# EAGLE design tek611 (EAGLE 6.6.0)
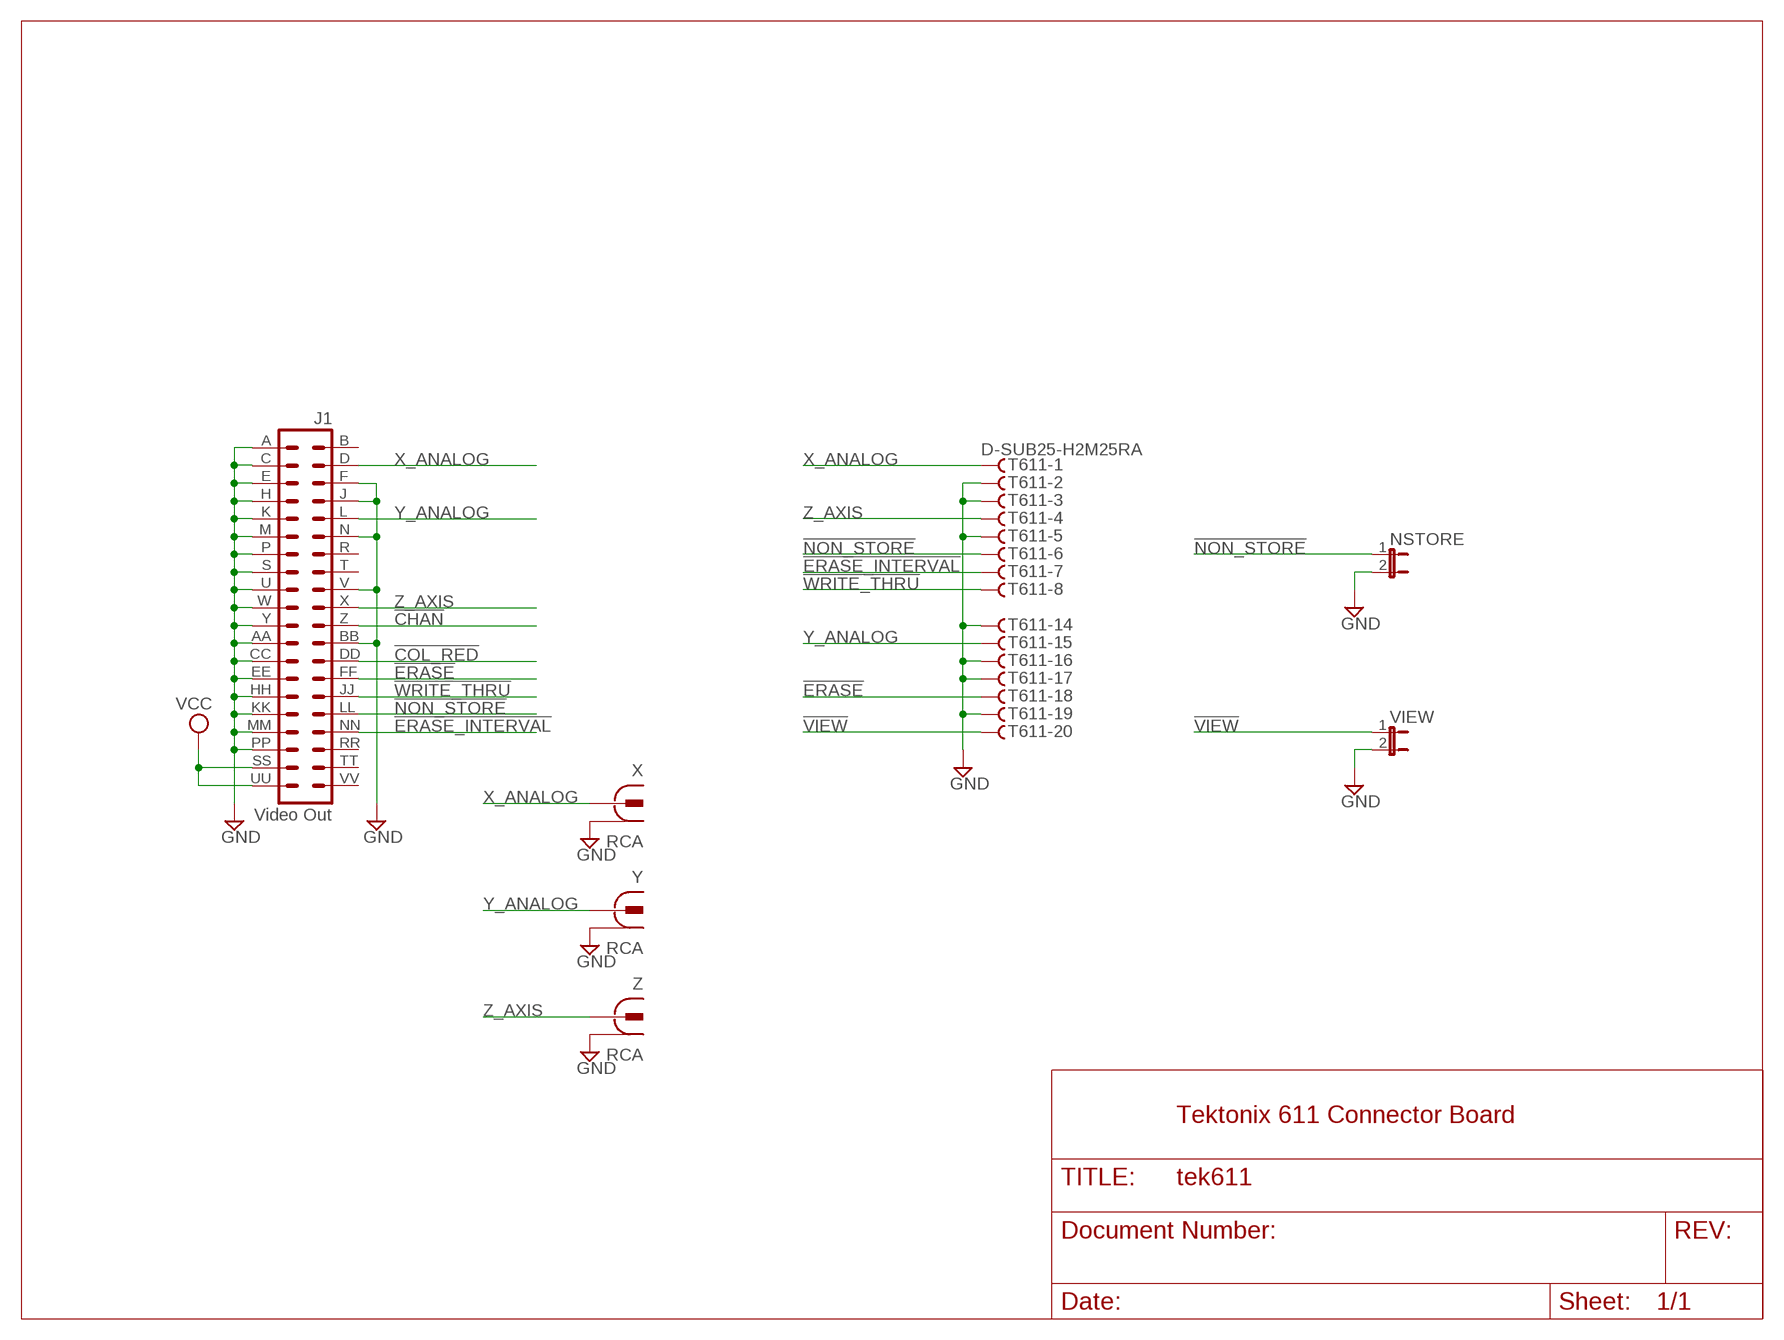
[diagram p0: schematic, sheet 1]

## Parts
J1  Video Out  DEC40PINH  [DEC40PINH]
NSTORE  JP1E  [JP1]
T611  D-SUB25-H2M25RA  [H2M25RA]
VIEW  JP1E  [JP1]
X  RCA  [RCA]
Y  RCA  [RCA]
Z  RCA  [RCA]

## Nets
!CHAN: J1.Z
!COL_RED: J1.DD
!ERASE: J1.FF T611.18
!ERASE_INTERVAL: J1.NN T611.7
!NON_STORE: J1.LL NSTORE.1 T611.6
!VIEW: T611.20 VIEW.1
!WRITE_THRU: J1.JJ T611.8
GND: J1.A J1.AA J1.BB J1.C J1.CC J1.E J1.EE J1.F J1.H J1.HH J1.J J1.K J1.KK J1.M J1.MM J1.N J1.P J1.PP J1.S J1.U J1.V J1.W J1.Y NSTORE.2 T611.2 T611.3 T611.5 T611.14 T611.16 T611.17 T611.19 VIEW.2 X.1 X.1@1 X.1@2 Y.1 Y.1@1 Y.1@2 Z.1 Z.1@1 Z.1@2
VCC [supply]: J1.SS J1.UU
X_ANALOG: J1.D T611.1 X.2
Y_ANALOG: J1.L T611.15 Y.2
Z_AXIS: J1.X T611.4 Z.2
Unconnected: J1.B J1.R J1.RR J1.T J1.TT J1.VV T611.9 T611.10 T611.11 T611.12 T611.13 T611.21 T611.22 T611.23 T611.24 T611.25

## Notes on the sheet
- Tektonix 611 Connector Board

## Library data of the parts
J1 = dec-con:DEC40PIN: PIN HEADER
NSTORE VIEW = jumper:JP1E: JUMPER
T611 = con-thomas-betts:D-SUB25-: D-Subminiatur Connector Source: Electronioc Interconnects European Edition 1998; OC_FARNELL: unknown; OC_NEWARK: unknown
X Y Z = dec-con:RCA: RCA Jack

## Net classes
0 default: width 0.61 mm
1 supply: width 0.61 mm

## Board
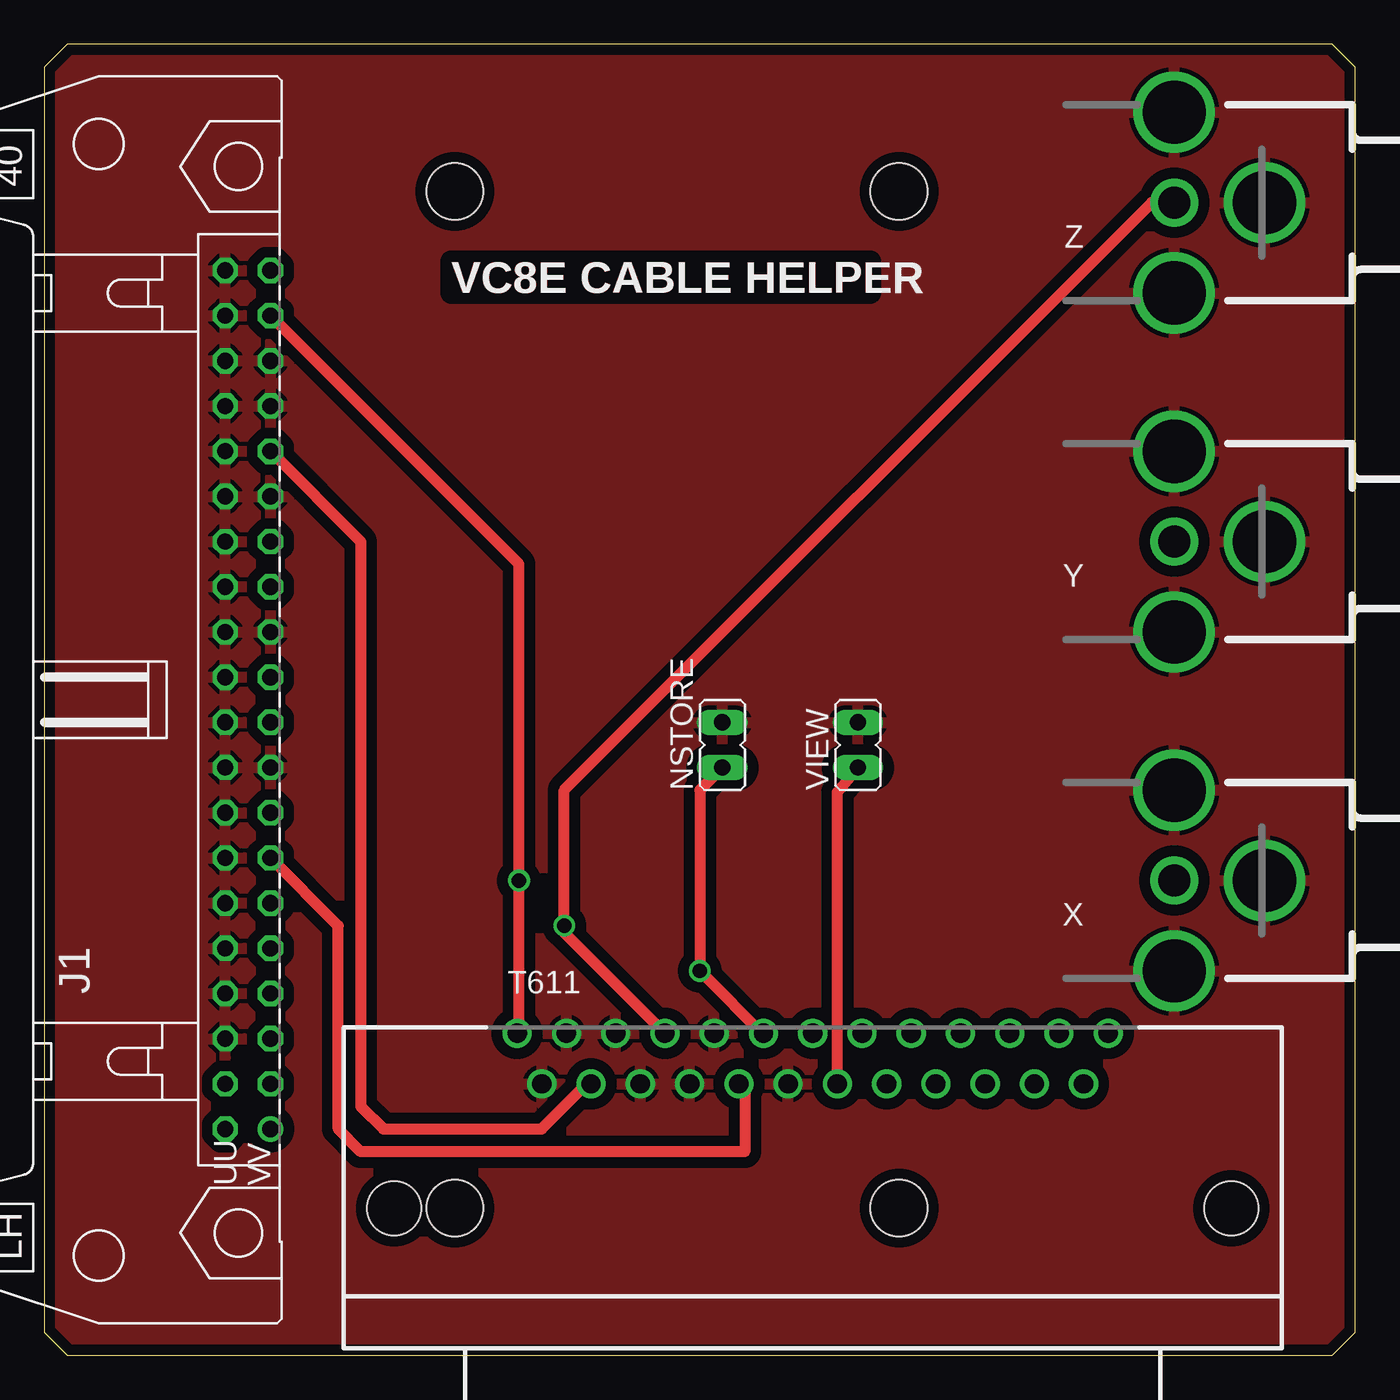
[diagram p1: board, top side]
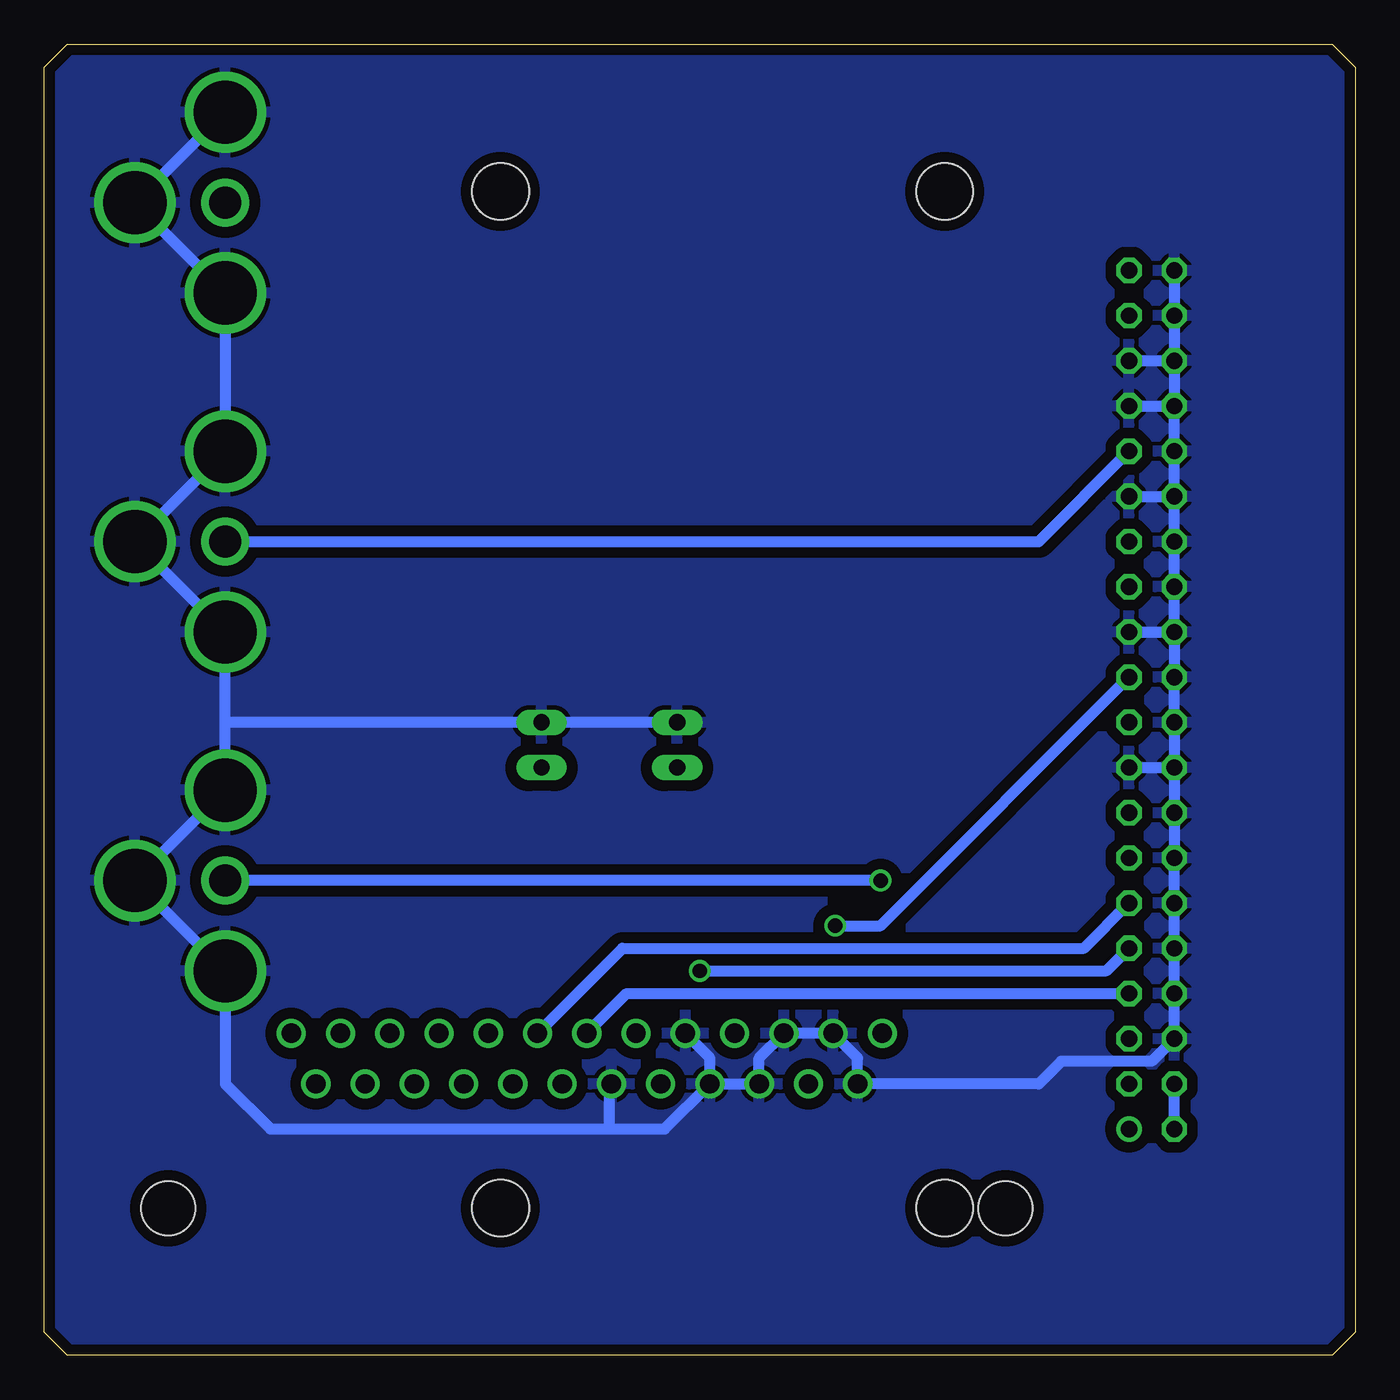
[diagram p2: board, bottom side, seen from below]

Size 73.66 x 73.66 mm. Coordinates in mm from the lower left corner, seen from the top.
Outline: 1.27,0 72.39,0 73.66,1.27 73.66,72.39 72.39,73.66 1.27,73.66 0,72.39 0,1.27 1.27,0
Copper layers (1+16): Top 0.035mm / dielectric 1.5mm / Bottom 0.035mm
Design rules "16mils": minimum track width 16mil, minimum drill 32mil, track to track 15mil, track to pad 10mil, pad to pad 10mil, via to via 10mil, smd to smd 10mil, copper to edge 13mil, drill to drill 10mil, minimum pad ring 10mil, minimum via ring 8mil, stop-mask expansion 0mil, vias tented up to drill 0mil, thermal gap 10mil
Holes 3.2 mm at 23.06,65.41 23.06,8.26 48.03,8.26 48.03,65.41

### Footprints (pad centres in the part's own frame; a part is rotated, then mirrored left to right if it is on the bottom)
DEC40PINH = drill 0.914 octagon: A 24.13,1.27; AA -3.81,1.27; B 24.13,-1.27; BB -3.81,-1.27; C 21.59,1.27; CC -6.35,1.27; D 21.59,-1.27; DD -6.35,-1.27; E 19.05,1.27; EE -8.89,1.27; F 19.05,-1.27; FF -8.89,-1.27; H 16.51,1.27; HH -11.43,1.27; J 16.51,-1.27; JJ -11.43,-1.27; K 13.97,1.27; KK -13.97,1.27; L 13.97,-1.27; LL -13.97,-1.27; M 11.43,1.27; MM -16.51,1.27; N 11.43,-1.27; NN -16.51,-1.27; P 8.89,1.27; PP -19.05,1.27; R 8.89,-1.27; RR -19.05,-1.27; S 6.35,1.27; SS -21.59,1.27; T 6.35,-1.27; TT -21.59,-1.27; U 3.81,1.27; UU -24.13,1.27; V 3.81,-1.27; W 1.27,1.27; X 1.27,-1.27; Y -1.27,1.27; Z -1.27,-1.27 | drill 0.914: VV -24.13,-1.27
JP1 = drill 0.914 long: 1 0,-1.27; 2 0,1.27
H2M25RA = drill 1.092: 1 -16.612,7.925; 2 -13.843,7.925; 3 -11.074,7.925; 4 -8.306,7.925; 5 -5.537,7.925; 6 -2.769,7.925; 7 0,7.925; 8 2.769,7.925; 9 5.537,7.925; 10 8.306,7.925; 11 11.074,7.925; 12 13.843,7.925; 13 16.612,7.925; 14 -15.227,5.08; 15 -12.459,5.08; 16 -9.69,5.08; 17 -6.921,5.08; 18 -4.153,5.08; 19 -1.384,5.08; 20 1.384,5.08; 21 4.153,5.08; 22 6.921,5.08; 23 9.69,5.08; 24 12.459,5.08; 25 15.227,5.08 | hole 3.048: -23.52,-1.905; 23.52,-1.905
RCA = drill 3.556: 1 -5.08,0; 1@1 0,-5.08; 1@2 0,5.08 | drill 1.8: 2 0,0

### Placement (x,y rotation side)
J1  11.43,36.83 90 top
NSTORE  38.1,34.29 0 top
T611  43.18,10.16 0 top
VIEW  45.72,34.29 0 top
X  63.5,26.67 180 top
Y  63.5,45.72 180 top
Z  63.5,64.77 180 top

### Tracks (layer width: path | path; a pad name or v marks a point on that pad's centre or on a via)
!ERASE
  Top 0.61: J1.FF 16.51,24.13 16.51,12.7 17.78,11.43 39.37,11.43 39.37,15.24 T611.18
!ERASE_INTERVAL
  Bottom 0.61: J1.NN 40.95,20.32 T611.7
!NON_STORE  (via drill 0.81)
  Top 0.61: T611.6 40.64,17.78 v36.83,21.59 36.83,31.75 NSTORE.1
  Bottom 0.61: J1.LL 13.97,21.59 v36.83,21.59
!VIEW
  Top 0.61: T611.20 44.56,31.64 VIEW.1
!WRITE_THRU
  Bottom 0.61: J1.JJ 15.24,22.86 41.17,22.86 T611.8
GND
  Bottom 0.61: J1.A J1.C J1.E | J1.F J1.E | J1.J J1.H | J1.E J1.H | J1.N J1.M | J1.M J1.K J1.H | J1.BB J1.AA | J1.AA J1.CC J1.EE J1.HH J1.KK J1.MM J1.PP 11.43,16.51 16.51,16.51 17.78,15.24 T611.14 27.95,16.7 T611.2 T611.3 33.49,16.7 T611.16 T611.17 | J1.AA J1.Y J1.W J1.U | J1.V J1.U | J1.U J1.S J1.P J1.M | 63.5,35.56 X.1@1 X.1 X.1@2 63.5,15.24 60.96,12.7 41.91,12.7 | 63.5,35.56 Y.1@2 Y.1 Y.1@1 Z.1@2 Z.1 Z.1@1 | T611.17 36.26,16.7 T611.5 | T611.17 38.8,12.7 41.91,12.7 | 41.91,12.7 41.91,15.13 T611.19 | 63.5,35.56 VIEW.2 NSTORE.2
  pour Top (isolate 0.61): 0,0 73.66,0 73.66,73.66 0,73.66
  pour Bottom (isolate 0.61): 0,0 73.66,0 73.66,73.66 0,73.66
VCC
  Bottom 0.61: J1.UU J1.SS
X_ANALOG  (via drill 0.81)
  Top 0.61: J1.D 26.67,44.45 v26.67,26.67 26.67,17.78 T611.1
  Bottom 0.61: v26.67,26.67 X.2
Y_ANALOG
  Top 0.61: J1.L 17.78,45.72 17.78,13.97 19.05,12.7 27.94,12.7 30.48,15.24 T611.15
  Bottom 0.61: J1.L 17.78,45.72 Y.2
Z_AXIS  (via drill 0.81)
  Top 0.61: Z.2 62.23,64.77 29.21,31.75 v29.21,24.13 29.21,23.75 T611.4
  Bottom 0.61: J1.X 26.67,24.13 v29.21,24.13

### Text on the board
Top: VC8E CABLE HELPER
tPlace: VC8E CABLE HELPER